# Altium schematic sheet MPU-Power.SchDoc
size A4; SheetNumber: 2; SheetTotal: 10
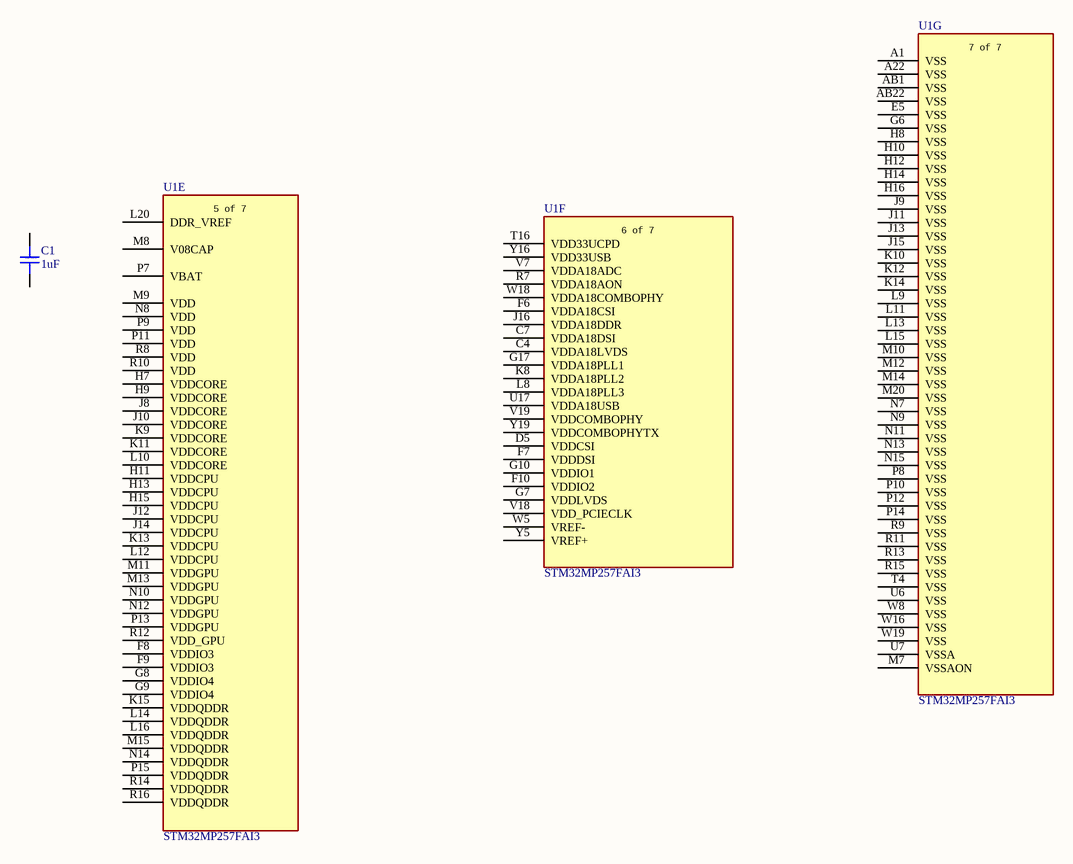
[diagram p0: MPU-Power.SchDoc]

## Parts
C1  1uF  [CAP_0402]
U1  STM32MP257FAI3  [TFBGA436_STM]  (parts E,F,G of 8)

## Nets

Not connected (* = marked no-connect by the designer): C1 1 2; U1 A1(VSS) A22(VSS) AB1(VSS) AB22(VSS) C4(VDDA18LVDS) C7(VDDA18DSI) D5(VDDCSI) E5(VSS) F6(VDDA18CSI) F7(VDDDSI) F8(VDDIO3) F9(VDDIO3) F10(VDDIO2) G6(VSS) G7(VDDLVDS) G8(VDDIO4) G9(VDDIO4) G10(VDDIO1) G17(VDDA18PLL1) H7(VDDCORE) H8(VSS) H9(VDDCORE) H10(VSS) H11(VDDCPU) H12(VSS) H13(VDDCPU) H14(VSS) H15(VDDCPU) H16(VSS) J8(VDDCORE) J9(VSS) J10(VDDCORE) J11(VSS) J12(VDDCPU) J13(VSS) J14(VDDCPU) J15(VSS) J16(VDDA18DDR) K8(VDDA18PLL2) K9(VDDCORE) K10(VSS) K11(VDDCORE) K12(VSS) K13(VDDCPU) K14(VSS) K15(VDDQDDR) L8(VDDA18PLL3) L9(VSS) L10(VDDCORE) L11(VSS) L12(VDDCPU) L13(VSS) L14(VDDQDDR) L15(VSS) L16(VDDQDDR) L20(DDR_VREF) M7(VSSAON) M8(V08CAP) M9(VDD) M10(VSS) M11(VDDGPU) M12(VSS) M13(VDDGPU) M14(VSS) M15(VDDQDDR) M20(VSS) N7(VSS) N8(VDD) N9(VSS) N10(VDDGPU) N11(VSS) N12(VDDGPU) N13(VSS) N14(VDDQDDR) N15(VSS) P7(VBAT) P8(VSS) P9(VDD) P10(VSS) P11(VDD) P12(VSS) P13(VDDGPU) P14(VSS) P15(VDDQDDR) R7(VDDA18AON) R8(VDD) R9(VSS) R10(VDD) R11(VSS) R12(VDD_GPU) R13(VSS) R14(VDDQDDR) R15(VSS) R16(VDDQDDR) T4(VSS) T16(VDD33UCPD) U6(VSS) U7(VSSA) U17(VDDA18USB) V7(VDDA18ADC) V18(VDD_PCIECLK) V19(VDDCOMBOPHY) W5(VREF-) W8(VSS) W16(VSS) W18(VDDA18COMBOPHY) W19(VSS) Y5(VREF+) Y16(VDD33USB) Y19(VDDCOMBOPHYTX)

## Notes on the sheet
- (in symbol Capacitor-SMD-0402) SMD 0402
- (in symbol STM32MP257FAI3, part E) 5 of 7
- (in symbol STM32MP257FAI3, part F) 6 of 7
- (in symbol STM32MP257FAI3, part G) 7 of 7

## Library data of the parts
C1 = Capacitor-SMD-0402: Capacitor SMD 0402 RATED
U1 = STM32MP257FAI3: MPU with Dual Arm Cortex-A35 @1.5GHz, Cortex-M33 @400MHz, 3xEthernet (2+1 switch), 3xFD-CAN, LVDS/DSI, H.264, 3D GPU, AI/NN, Secure Boot, Cryptography, DRAM enc/dec, PKA; Manufacturer_Name: STMicroelectronics; Copyright: Copyright (C) 2025 Ultra Librarian. All rights reserved.; Manufacturer_Part_Number: STM32MP257FAI3; RefDes: RefDes; Type: Type